# Altium project MEM_M_V1.PrjPcb
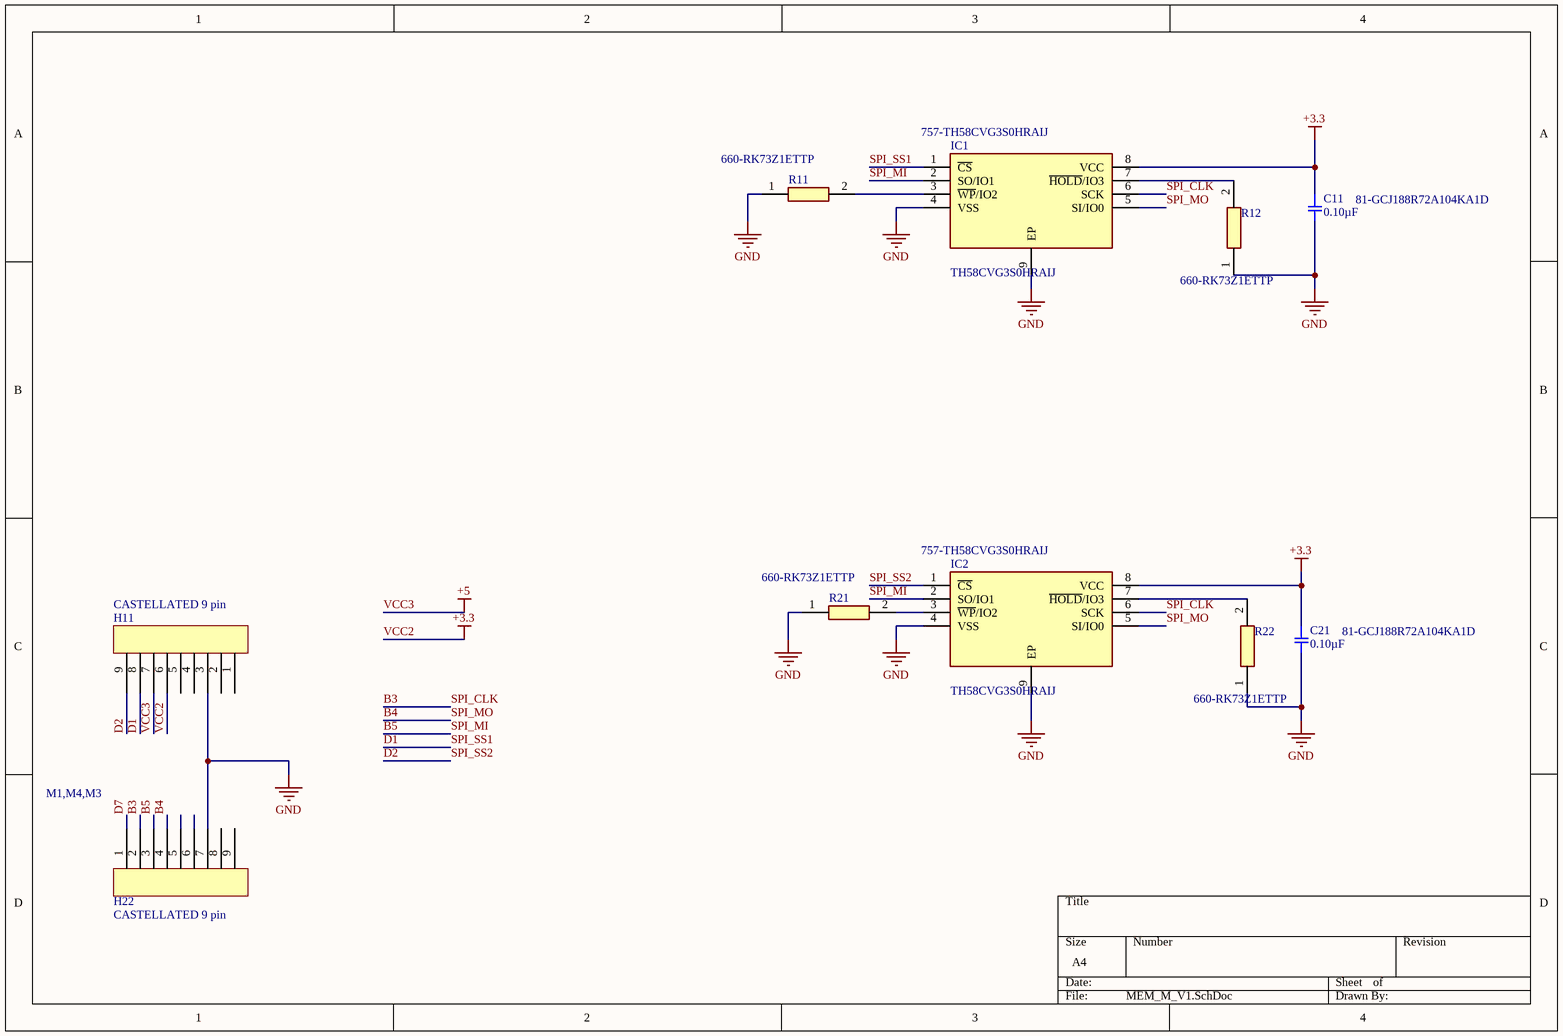
[diagram p0: MEM_M_V1.SchDoc]
1 sheet, 10 parts. Net scope: global (net labels, ports and power ports of the same name join across sheets).
Board file: MEM_M_V1.PcbDoc

## Sheet MEM_M_V1.SchDoc
size A4

### Parts
C11  0.10µF  Supplier Part Number 1: 81-GCJ188R72A104KA1D  [SMD-0603C]
C21  0.10µF  Supplier Part Number 1: 81-GCJ188R72A104KA1D  [SMD-0603C]
H11  CASTELLATED 9 pin  [CASTELLATED 9 pin]
H22  CASTELLATED 9 pin  [CASTELLATED 9 pin]
IC1  TH58CVG3S0HRAIJ  Supplier Part Number 1: 757-TH58CVG3S0HRAIJ  [SON127P800X600X80-9N-D]
IC2  TH58CVG3S0HRAIJ  Supplier Part Number 1: 757-TH58CVG3S0HRAIJ  [SON127P800X600X80-9N-D]
R11  Supplier Part Number 1: 660-RK73Z1ETTP  [RESC1005X40N]  (hidden comment: RK73Z1ETTP)
R12  Supplier Part Number 1: 660-RK73Z1ETTP  [RESC1005X40N]  (hidden comment: RK73Z1ETTP)
R21  Supplier Part Number 1: 660-RK73Z1ETTP  [RESC1005X40N]  (hidden comment: RK73Z1ETTP)
R22  Supplier Part Number 1: 660-RK73Z1ETTP  [RESC1005X40N]  (hidden comment: RK73Z1ETTP)

### Nets
GND: C11.2 C21.2 H11.3 H22.7 IC1.4(VSS) IC1.9(EP) IC2.4(VSS) IC2.9(EP) R11.1 R12.1 R21.1 R22.1
VCC2: C11.1 C21.1 H11.6 IC1.8(VCC) IC2.8(VCC)  [also labelled +3.3]
VCC3: H11.7  [also labelled +5]
B3: H22.2 IC1.6(SCK) IC2.6(SCK)  [also labelled SPI_CLK]
B4: H22.4 IC1.5(SI/IO0) IC2.5(SI/IO0)  [also labelled SPI_MO]
B5: H22.3 IC1.2(SO/IO1) IC2.2(SO/IO1)  [also labelled SPI_MI]
D1: H11.8 IC1.1(~{CS})  [also labelled SPI_SS1]
D2: H11.9 IC2.1(~{CS})  [also labelled SPI_SS2]
D7: H22.1
NetIC1_3: IC1.3(~{WP}/IO2) R11.2
NetIC1_7: IC1.7(~{HOLD}/IO3) R12.2
NetIC2_3: IC2.3(~{WP}/IO2) R21.2
NetIC2_7: IC2.7(~{HOLD}/IO3) R22.2

Not connected (* = marked no-connect by the designer): H11 1 2 4 5; H22 5 6 8 9

### Notes on the sheet
- M1,M4,M3

### Library data of the parts
C11 C21 = GCJ188R72A104KA01D: CAP CER 0.1UF 100V X7R 0603; Manufacturer: Murata Electronics North America; Factory Stock: 0; Unit Price (USD): 0,23; Minimum Quantity: 1; Tolerance: ±10%; Part Number: GCJ188R72A104KA01D; Datasheets: http://www.murata.com/~/media/webrenewal/support/library/catalog/products/capacitor/mlcc/c03e.ashx; Image: //media.digikey.com/Renders/Murata%20Renders/0603%28LQG18%29.jpg; Digi-Key Part Number: 490-13420-1-ND; Quantity Available: 2728; @ qty: 0; Packaging: Cut Tape (CT); Series: GCJ; Part Status: Active; Value: 0.10µF; Voltage: 100V; Temperature Coefficient: X7R; Operating Temperature: -55°C ~ 125°C; Features: Soft Termination; Ratings: AEC-Q200; Applications: Automotive, Boardflex Sensitive; Mounting Type: Surface Mount, MLCC; Package / Case: 0603 (1608 Metric); Size / Dimension: 0.063" L x 0.031" W (1.60mm x 0.80mm); Height - Seated (Max): -; Thickness (Max): 0.035" (0.90mm); Lead Spacing: -; Lead Style: -; Supplier 1: Mouser
IC1 IC2 = TH58CVG3S0HRAIJ: Integrated Circuit; Manufacturer_Name: Kioxia America; Datasheet Link: https://business.kioxia.com/info/docget.jsp?did=58602&prodName=TH58CVG3S0HRAIJ; Height: 0.8mm; Manufacturer_Part_Number: TH58CVG3S0HRAIJ; Supplier 1: Mouser
R11 R12 R21 R22 = RK73Z1ETTP: Resistor; Manufacturer_Name: KOA Speer; Height: 0.4mm; Manufacturer_Part_Number: RK73Z1ETTP; Supplier 1: Mouser